# EAGLE design L293D (EAGLE 9.3.0)
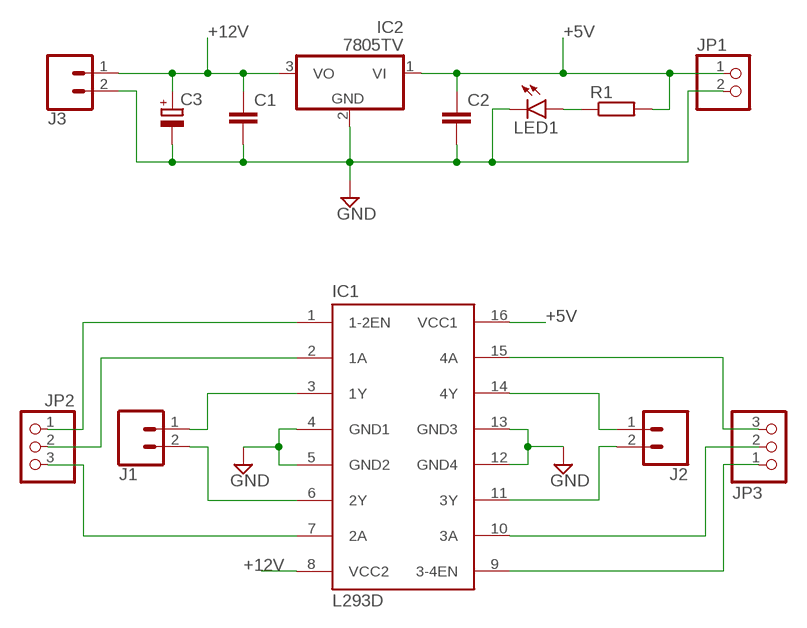
[diagram p0: schematic, sheet 1]

## Parts
C1  C-EU025-024X044  [C025-024X044]
C2  C-EU025-024X044  [C025-024X044]
C3  CPOL-EUE2.5-5  [E2,5-5]
IC1  L293D  [DIL16]
IC2  7805TV  [TO220V]
J1  CONN_025MM  [SCREWTERMINAL-5MM-2]
J2  CONN_025MM  [SCREWTERMINAL-5MM-2]
J3  CONN_025MM  [SCREWTERMINAL-5MM-2]
JP1  PINHD-1X2  [1X02]
JP2  PINHD-1X3  [1X03]
JP3  PINHD-1X3  [1X03]
LED1  LED5MM  [LED5MM]
R1  R-EU_0204/7  [0204/7]

## Nets
+5V: C2.1 IC1.16(VCC1) IC2.1(VI) JP1.1 R1.2
+12V: C1.1 C3.+ IC1.8(VCC2) IC2.3(VO) J3.1
GND: C1.2 C2.2 C3.- IC1.4(GND1) IC1.5(GND2) IC1.12(GND4) IC1.13(GND3) IC2.2(GND) J3.2 JP1.2 LED1.K(C)
N$1: IC1.3(1Y) J1.1
N$2: IC1.6(2Y) J1.2
N$3: IC1.14(4Y) J2.1
N$4: IC1.11(3Y) J2.2
N$5: IC1.1(1-2EN) JP2.1
N$6: IC1.2(1A) JP2.2
N$8: IC1.7(2A) JP2.3
N$9: LED1.A R1.1
N$10: IC1.9(3-4EN) JP3.1
N$11: IC1.10(3A) JP3.2
N$12: IC1.15(4A) JP3.3

## Library data of the parts
C1 C2 = rcl:C-EU: CAPACITOR, European symbol; SPICEPREFIX: C
C3 = resistor:CPOL-EU: POLARIZED CAPACITOR, European symbol
IC1 = st-microelectronics:L293D: PUSH-PULL 4 CHANNEL DRIVER; MPN: L293D; OC_FARNELL: 9589619; OC_NEWARK: 56P8249
IC2 = linear:78*: Positive VOLTAGE REGULATOR Source: http://cache.national.com/ds/LM/LM78L05.pdf http://www.fairchildsemi.com/ds/LM/LM7805.pdf
J1-J3 = SparkFun-Retired:CONN_02: Multi connection point. Often used as Generic Header-pin footprint for 0.1 inch spaced/style header connections On any of the 0.1 inch spaced packages, you can populate with these: Break Away Headers - Straight <https://www.sparkfun.com/products/116> (PRT-00116) Break Away Male Headers - Right Angle <https://www.sparkfun.com/products/553> (PRT-00553) Female Headers <https://www.sparkfun.com/products/115> (PRT-00115) Break Away Headers - Machine Pin <https://www.sparkfun.com/products/117> (PRT-00117) Break Away Female Headers - Swiss Machine Pin <https://www.sparkfun.com/products/743> (PRT-00743) For SCREWTERMINALS and SPRING TERMINALS visit here: Screw Terimnals on SparkFun.com <https://www.sparkfun.com/search/results?term=Screw+Terminals> (5mm/3.5mm/2.54mm spacing) This device is also useful as a general connection point to wire up your design to another part of your project. Our various solder wires solder well into these plated through hole pads. Hook-Up Wire - Assortment (Stranded, 22 AWG) <https://www.sparkfun.com/products/11375> (PRT-11375) Hook-Up Wire - Assortment (Solid Core, 22 AWG) <https://www.sparkfun.com/products/11367> (PRT-11367) View the entire wire category on our website here <https://www.sparkfun.com/categories/141> Special notes: Molex polarized connector foot print use with: PRT-08233 with associated crimp pins and housings. 2.54_SCREWTERM for use with PRT-10571. 3.5mm Screw Terminal footprints for PRT-08084 5mm Screw Terminal footprints for use with PRT-08432; SF_SKU: PRT-08432
JP1 = pinhead:PINHD-1X2: PIN HEADER
JP2 JP3 = pinhead:PINHD-1X3: PIN HEADER
LED1 = led:LED: LED OSRAM: - CHIPLED LG R971, LG N971, LY N971, LG Q971, LY Q971, LO R971, LY R971 LH N974, LH R974 LS Q976, LO Q976, LY Q976 LO Q996 - Hyper CHIPLED LW Q18S LB Q993, LB Q99A, LB R99A - SideLED LS A670, LO A670, LY A670, LG A670, LP A670 LB A673, LV A673, LT A673, LW A673 LH A674 LY A675 LS A676, LA A676, LO A676, LY A676, LW A676 LS A679, LY A679, LG A679 - Hyper Micro SIDELED® LS Y876, LA Y876, LO Y876, LY Y876 LT Y87S - SmartLED LW L88C, LW L88S LB L89C, LB L89S, LG L890 LS L89K, LO L89K, LY L89K LS L896, LA L896, LO L896, LY L896 - TOPLED LS T670, LO T670, LY T670, LG T670, LP T670 LSG T670, LSP T670, LSY T670, LOP T670, LYG T670 LG T671, LOG T671, LSG T671 LB T673, LV T673, LT T673, LW T673 LH T674 LS T676, LA T676, LO T676, LY T676, LB T676, LH T676, LSB T676, LW T676 LB T67C, LV T67C, LT T67C, LS T67K, LO T67K, LY T67K, LW E67C LS E67B, LA E67B, LO E67B, LY E67B, LB E67C, LV E67C, LT E67C LW T67C LS T679, LY T679, LG T679 LS T770, LO T770, LY T770, LG T770, LP T770 LB T773, LV T773, LT T773, LW T773 LH T774 LS E675, LA E675, LY E675, LS T675 LS T776, LA T776, LO T776, LY T776, LB T776 LHGB T686 LT T68C, LB T68C - Hyper Mini TOPLED® LB M676 - Mini TOPLED Santana® LG M470 LS M47K, LO M47K, LY M47K Source: http://www.osram.convergy.de LUXEON: - LUMILED® LXK2-PW12-R00, LXK2-PW12-S00, LXK2-PW14-U00, LXK2-PW14-V00 LXK2-PM12-R00, LXK2-PM12-S00, LXK2-PM14-U00 LXK2-PE12-Q00, LXK2-PE12-R00, LXK2-PE12-S00, LXK2-PE14-T00, LXK2-PE14-U00 LXK2-PB12-K00, LXK2-PB12-L00, LXK2-PB12-M00, LXK2-PB14-N00, LXK2-PB14-P00, LXK2-PB14-Q00 LXK2-PR12-L00, LXK2-PR12-M00, LXK2-PR14-Q00, LXK2-PR14-R00 LXK2-PD12-Q00, LXK2-PD12-R00, LXK2-PD12-S00 LXK2-PH12-R00, LXK2-PH12-S00 LXK2-PL12-P00, LXK2-PL12-Q00, LXK2-PL12-R00 Source: www.luxeon.com KINGBRIGHT: KA-3528ASYC Source: www.kingbright.com
R1 = rcl:R-EU_: RESISTOR, European symbol; SPICEPREFIX: R

## Board
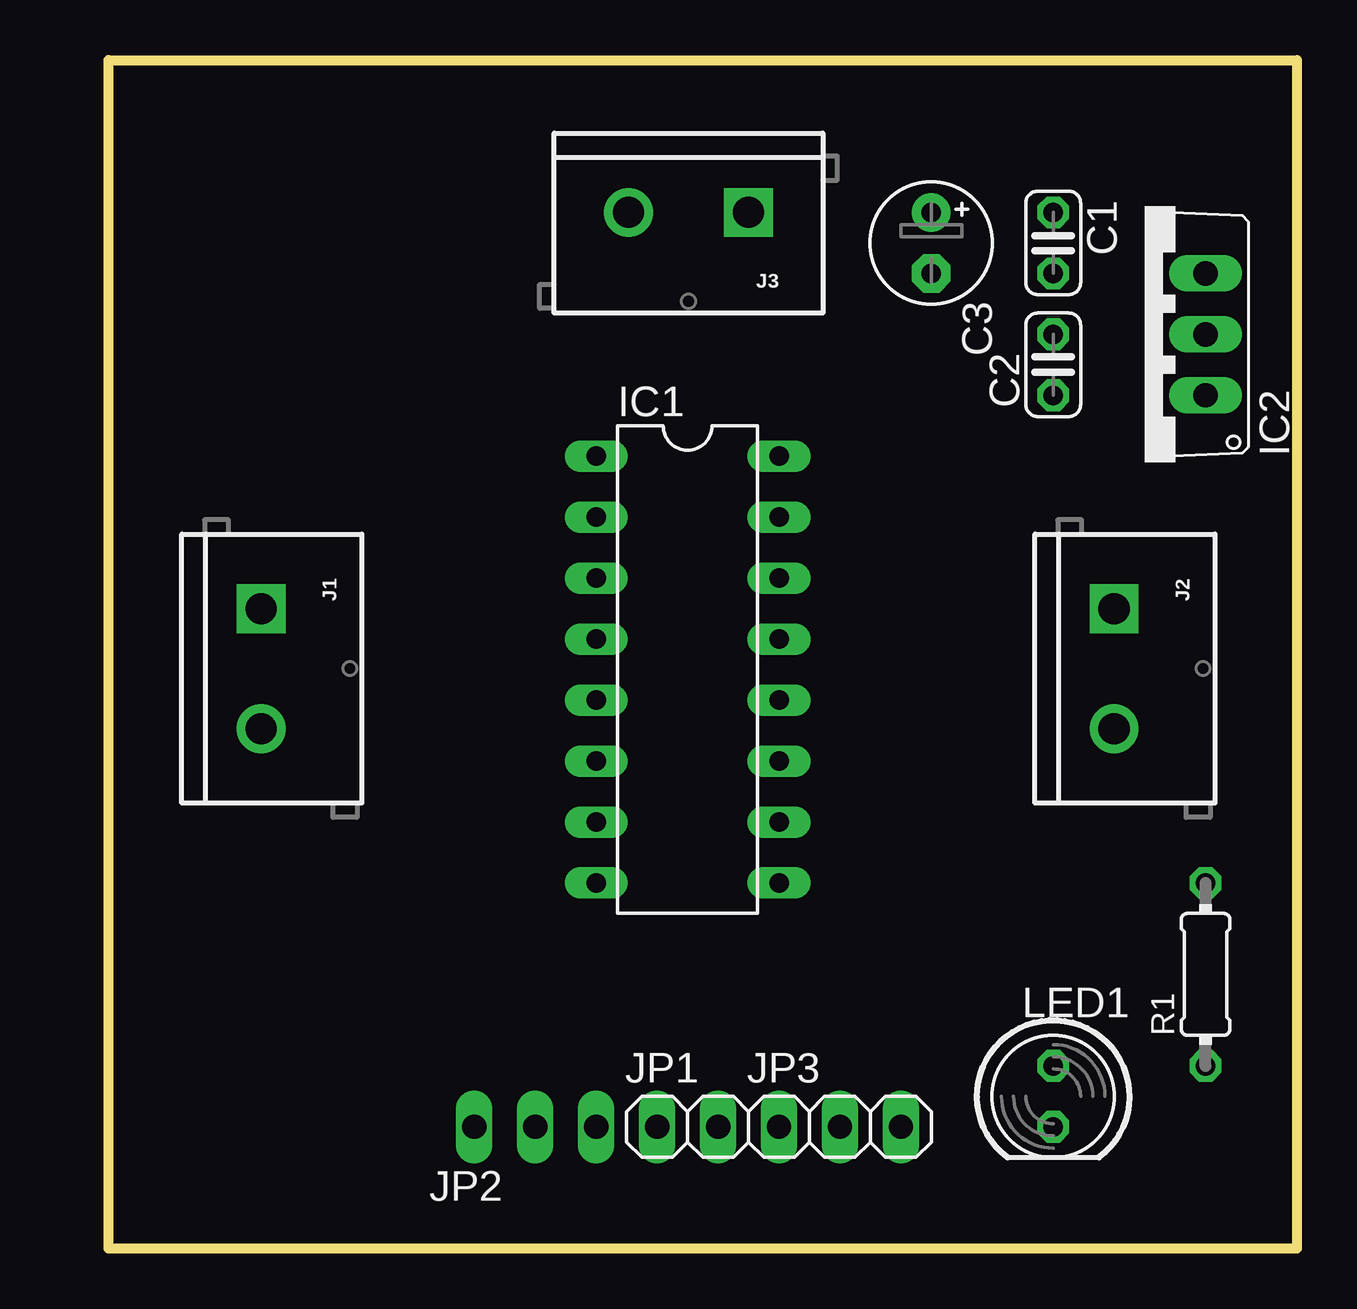
[diagram p1: board, top side]
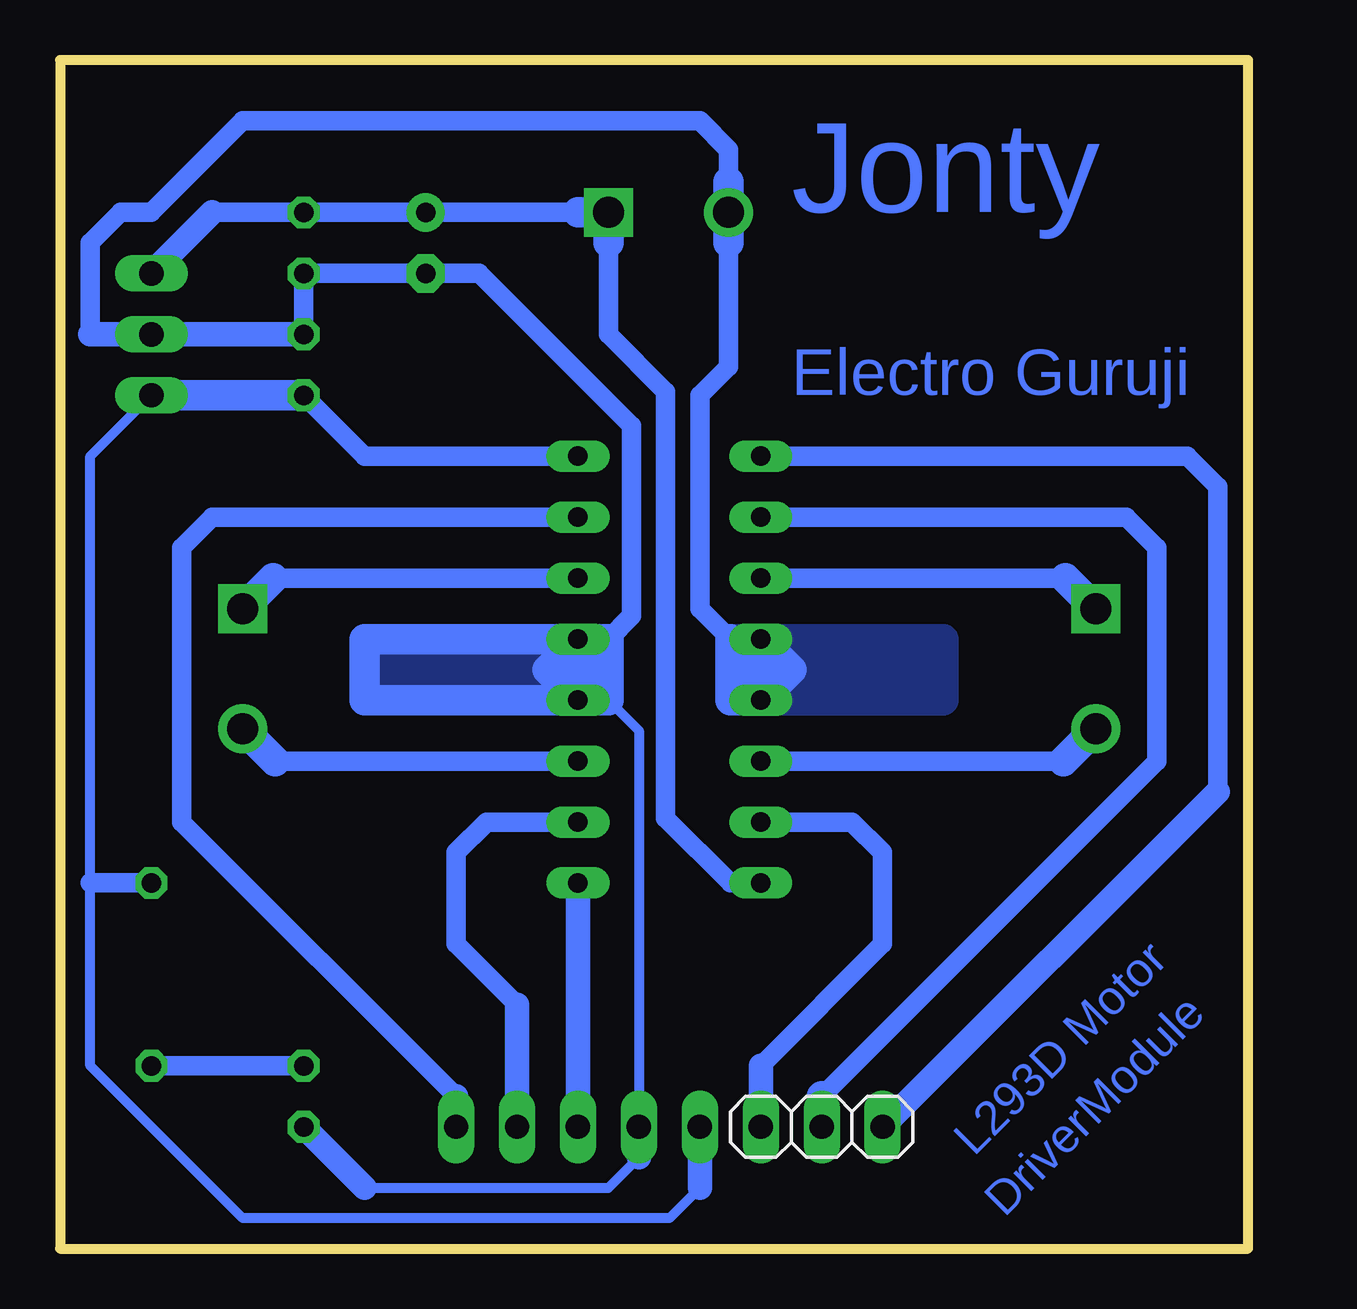
[diagram p2: board, bottom side, seen from below]

Size 49.53 x 49.53 mm. Coordinates in mm from the lower left corner, seen from the top.
Outline: 0,49.53 49.53,49.53 49.53,0 0,0 0,49.53
Copper layers (1*16): Top 0.035mm / dielectric 1.5mm / Bottom 0.035mm
Design rules "default": minimum track width 6mil, minimum drill 0.35mm, track to track 6mil, track to pad 6mil, pad to pad 6mil, via to via 6mil, smd to smd 6mil, copper to edge 40mil, drill to drill 6mil, minimum pad ring 10mil, minimum via ring 8mil, stop-mask expansion 4mil, vias tented up to drill 0mil, thermal gap 10mil

### Footprints (pad centres in the part's own frame; a part is rotated, then mirrored left to right if it is on the bottom)
C025-024X044 = drill 0.813 octagon: 1 -1.27,0; 2 1.27,0
E2,5-5 = drill 0.813 pad 1.6: + -1.27,0 | drill 0.813 pad 1.6 octagon: - 1.27,0
DIL16 = drill 0.813 long: 1 -8.89,-3.81; 2 -6.35,-3.81; 3 -3.81,-3.81; 4 -1.27,-3.81; 5 1.27,-3.81; 6 3.81,-3.81; 7 6.35,-3.81; 8 8.89,-3.81; 9 8.89,3.81; 10 6.35,3.81; 11 3.81,3.81; 12 1.27,3.81; 13 -1.27,3.81; 14 -3.81,3.81; 15 -6.35,3.81; 16 -8.89,3.81
TO220V = drill 1.016 long: 1 -2.54,-2.54; 2 0,-2.54; 3 2.54,-2.54
SCREWTERMINAL-5MM-2 = drill 1.3 pad 2.032 square: 1 0,0 | drill 1.3 pad 2.032: 2 5,0
1X02 = drill 1.016 long: 1 -1.27,0; 2 1.27,0
1X03 = drill 1.016 long: 1 -2.54,0; 2 0,0; 3 2.54,0
LED5MM = drill 0.813 octagon: A -1.27,0; K 1.27,0
0204/7 = drill 0.813 octagon: 1 -3.81,0; 2 3.81,0

### Placement (x,y rotation side)
C1  39.37,41.91 270 top
C2  39.37,36.83 90 top
C3  34.29,41.91 270 top
IC1  24.13,24.13 270 top
IC2  43.18,38.1 90 top
J1  6.35,26.67 270 top
J2  41.91,26.67 270 top
J3  26.67,43.18 180 top
JP1  24.13,5.08 0 top
JP2  17.78,5.08 180 bottom
JP3  30.48,5.08 0 top
LED1  39.37,6.35 270 top
R1  45.72,11.43 90 top

### Tracks (layer width: path | path; a pad name or v marks a point on that pad's centre or on a via)
+5V
  Bottom 0.406: 22.86,2.54 24.13,1.27 41.91,1.27 48.26,7.62 48.26,15.24 | 48.26,15.24 48.26,33.02 IC2.1 | 48.26,15.24
  Bottom 0.813: IC1.16 36.83,33.02 C2.1 | R1.2 48.26,15.24
  Bottom 1.016: JP1.1 22.86,2.54
  Bottom 1.27: IC2.1 C2.1
+12V
  Bottom 0.813: 27.94,43.18 C3.+ C1.1 43.18,43.18 | 26.67,41.91 26.67,38.1 24.28,35.71 24.28,17.93 21.59,15.24 IC1.8
  Bottom 1.016: 43.18,43.18 IC2.3
  Bottom 1.27: 27.94,43.18 J3.1 26.67,41.91
GND
  Bottom 0.406: 26.67,22.86 25.4,21.59 JP1.2 | 36.83,2.54 26.67,2.54 25.4,3.81
  Bottom 0.813: 48.26,38.1 48.26,41.91 46.99,43.18 45.72,43.18 41.91,46.99 22.86,46.99 21.67,45.8 21.67,44.45 J3.2 21.67,41.91 21.67,36.75 22.86,35.56 22.86,26.67 21.59,25.4 IC1.4 | C2.2 C1.2 C3.- 32.06,40.64 25.7,34.29 25.7,26.36 26.67,25.4
  Bottom 1.016: 48.26,38.1 IC2.2 C2.2 | LED1.K 36.83,2.54 | 25.4,3.81 JP1.2
  Bottom 1.27: IC1.12 26.67,22.86 26.67,25.4 IC1.13 | IC1.13 IC1.12 | IC1.13 29.21,24.13 IC1.12 | IC1.5 19.05,24.13 IC1.4 IC1.5 | IC1.5 21.59,22.86 21.59,25.4 | IC1.13 36.83,25.4 36.83,22.86 IC1.12 | 21.67,44.45 21.67,41.91
  pour Bottom: 27.94,25.4 26.67,25.4 26.67,22.86 36.83,22.86 36.83,25.4
  pour Bottom: 20.32,25.4 21.59,25.4 21.59,22.86 12.7,22.86 12.7,25.4
N$1
  Bottom 0.813: 7.62,27.94 IC1.3
  Bottom 1.27: J1.1 7.62,27.94
N$2
  Bottom 0.813: 7.7,20.32 IC1.6
  Bottom 1.27: J1.2 7.7,20.32
N$3
  Bottom 0.813: 40.64,27.94 IC1.14
  Bottom 1.27: J2.1 40.64,27.94
N$4
  Bottom 0.813: 40.56,20.32 IC1.11
  Bottom 1.27: J2.2 40.56,20.32
N$5
  Bottom 0.813: 1.27,19.05 1.27,31.75 2.54,33.02 IC1.1
  Bottom 1.016: JP2.1 1.27,19.05
N$6
  Bottom 0.813: 17.78,6.35 3.81,20.32 3.81,29.21 5.08,30.48 IC1.2
  Bottom 1.27: JP2.2 17.78,6.35
N$8
  Bottom 0.813: IC1.7 16.51,17.78 15.24,16.51 15.24,12.7 20.32,7.62
  Bottom 1.016: 20.32,7.62 JP2.3
N$9
  Bottom 0.813: LED1.A R1.1
N$10
  Bottom 1.016: IC1.9 JP3.1
N$11
  Bottom 0.813: 30.48,10.16 33.02,12.7 33.02,16.51 31.75,17.78 IC1.10
  Bottom 1.016: JP3.2 30.48,10.16
N$12
  Bottom 0.813: IC1.15 43.18,30.48 44.45,29.21 44.45,17.78 33.02,6.35
  Bottom 1.016: 33.02,6.35 JP3.3

### Text on the board
Bottom: Jonty | Electro Guruji | Module | L293D Motor | Driver